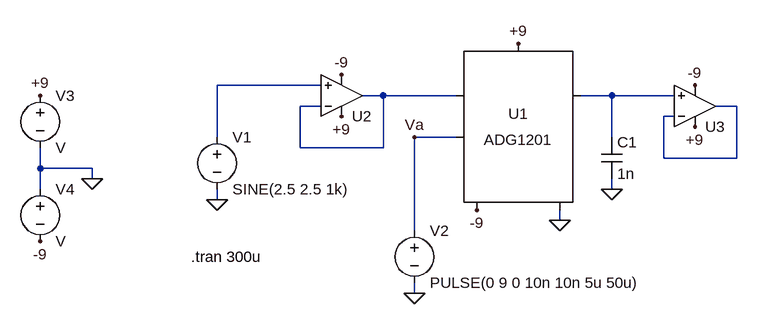
[diagram p0: schematic Draft1.asc]
Draft1.asc, the LTspice schematic file:
Version 4
SHEET 1 880 680
WIRE -96 112 -256 112
WIRE 0 128 -32 128
WIRE 112 128 0 128
WIRE 352 128 304 128
WIRE 448 128 352 128
WIRE -96 144 -128 144
WIRE 544 144 512 144
WIRE 448 160 432 160
WIRE -256 192 -256 112
WIRE 112 192 48 192
WIRE 352 192 352 128
WIRE -128 208 -128 144
WIRE 0 208 0 128
WIRE 0 208 -128 208
WIRE 432 224 432 160
WIRE 544 224 544 144
WIRE 544 224 432 224
WIRE -528 240 -528 208
WIRE -448 240 -528 240
WIRE -448 256 -448 240
WIRE -528 272 -528 240
WIRE 352 272 352 256
WIRE -256 288 -256 272
WIRE 272 320 272 304
WIRE 48 336 48 192
WIRE 48 432 48 416
FLAG -64 96 -9
FLAG -64 160 +9
FLAG -256 288 0
FLAG 48 432 0
FLAG 144 304 -9
FLAG 272 320 0
FLAG 208 48 +9
FLAG 480 112 -9
FLAG 480 176 +9
FLAG 352 272 0
FLAG -448 256 0
FLAG -528 128 +9
FLAG -528 352 -9
FLAG 48 192 Va
SYMBOL Switches\\ADG1201 208 176 R0
SYMATTR InstName U1
SYMBOL OpAmps\\UniversalOpAmp -64 128 M180
SYMATTR InstName U2
SYMBOL voltage -256 176 R0
WINDOW 123 0 0 Left 0
WINDOW 39 0 0 Left 0
SYMATTR InstName V1
SYMATTR Value SINE(2.5 2.5 1k)
SYMBOL voltage 48 320 R0
WINDOW 123 0 0 Left 0
WINDOW 39 0 0 Left 0
SYMATTR InstName V2
SYMATTR Value PULSE(0 9 0 10n 10n 5u 50u)
SYMBOL cap 336 192 R0
SYMATTR InstName C1
SYMATTR Value 1n
SYMBOL voltage -528 112 R0
SYMATTR InstName V3
SYMBOL voltage -528 256 R0
SYMATTR InstName V4
SYMBOL OpAmps\\UniversalOpAmp 480 144 M180
SYMATTR InstName U3
TEXT -296 376 Left 2 !.tran 300u

The netlist it stands for:
* Draft1.asc
XU1 Va N003 N002 -9 0 +9 ADG1201
XU2 N001 N002 +9 -9 N002 level1 Avol=1Meg GBW=10Meg Vos=0 En=0 Enk=0 In=0 Ink=0 Rin=500Meg  ; pins In+ In- V+ V- OUT
V1 N001 0 SINE(2.5 2.5 1k)
V2 Va 0 PULSE(0 9 0 10n 10n 5u 50u)
C1 N003 0 1n
V3 +9 0 V
V4 0 -9 V
XU3 N003 N004 +9 -9 N004 level1 Avol=1Meg GBW=10Meg Vos=0 En=0 Enk=0 In=0 Ink=0 Rin=500Meg  ; pins In+ In- V+ V- OUT
.tran 300u
.lib ADG1201.sub
.lib UniversalOpAmp1.lib
.backanno
.end